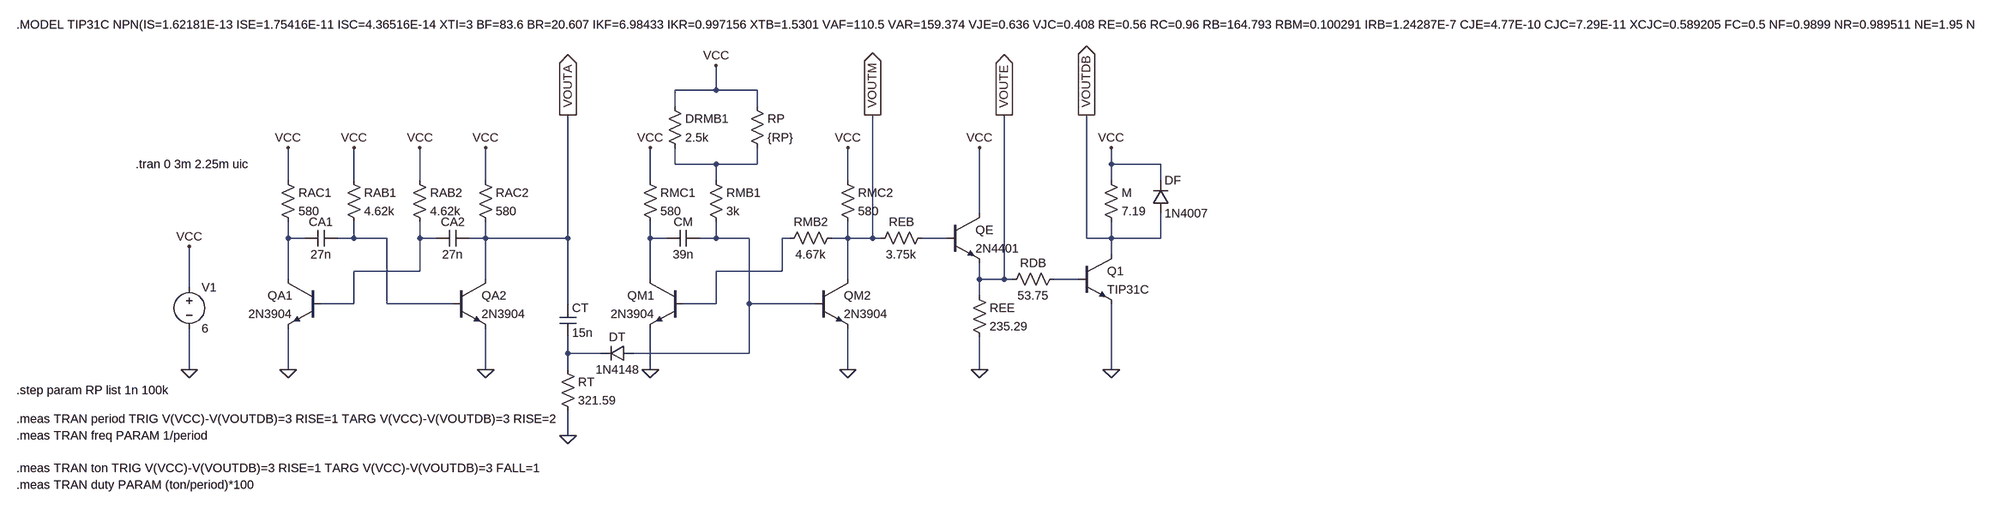
[diagram p0: schematic partly.asc]
partly.asc, the LTspice schematic file:
Version 4.1
SHEET 1 5716 680
WIRE 1056 -304 1056 -352
WIRE 1056 -304 976 -304
WIRE 1136 -304 1056 -304
WIRE 976 -272 976 -304
WIRE 1136 -272 1136 -304
WIRE 976 -160 976 -192
WIRE 1056 -160 976 -160
WIRE 1136 -160 1136 -192
WIRE 1136 -160 1056 -160
WIRE 1824 -160 1824 -192
WIRE 1920 -160 1824 -160
WIRE 224 -128 224 -192
WIRE 352 -128 352 -192
WIRE 480 -128 480 -192
WIRE 608 -128 608 -192
WIRE 928 -128 928 -192
WIRE 1056 -128 1056 -160
WIRE 1312 -128 1312 -192
WIRE 1824 -128 1824 -160
WIRE 1920 -128 1920 -160
WIRE 1568 -64 1568 -192
WIRE 224 -16 224 -48
WIRE 256 -16 224 -16
WIRE 352 -16 352 -48
WIRE 352 -16 320 -16
WIRE 416 -16 352 -16
WIRE 480 -16 480 -48
WIRE 512 -16 480 -16
WIRE 608 -16 608 -48
WIRE 608 -16 576 -16
WIRE 768 -16 768 -256
WIRE 768 -16 608 -16
WIRE 928 -16 928 -48
WIRE 960 -16 928 -16
WIRE 1056 -16 1056 -48
WIRE 1056 -16 1024 -16
WIRE 1120 -16 1056 -16
WIRE 1200 -16 1184 -16
WIRE 1312 -16 1312 -48
WIRE 1312 -16 1280 -16
WIRE 1360 -16 1360 -256
WIRE 1360 -16 1312 -16
WIRE 1376 -16 1360 -16
WIRE 1504 -16 1456 -16
WIRE 1776 -16 1776 -256
WIRE 1824 -16 1824 -48
WIRE 1824 -16 1776 -16
WIRE 1920 -16 1920 -64
WIRE 1920 -16 1824 -16
WIRE 1824 16 1824 -16
WIRE 480 48 480 -16
WIRE 480 48 352 48
WIRE 1184 48 1184 -16
WIRE 1184 48 1056 48
WIRE 224 64 224 -16
WIRE 608 64 608 -16
WIRE 928 64 928 -16
WIRE 1312 64 1312 -16
WIRE 1568 64 1568 32
WIRE 1616 64 1616 -256
WIRE 1616 64 1568 64
WIRE 1632 64 1616 64
WIRE 1760 64 1712 64
WIRE 32 80 32 0
WIRE 1568 96 1568 64
WIRE 352 112 352 48
WIRE 352 112 288 112
WIRE 416 112 416 -16
WIRE 544 112 416 112
WIRE 768 112 768 -16
WIRE 1056 112 1056 48
WIRE 1056 112 992 112
WIRE 1120 112 1120 -16
WIRE 1248 112 1120 112
WIRE 768 208 768 176
WIRE 832 208 768 208
WIRE 1120 208 1120 112
WIRE 1120 208 896 208
WIRE 32 240 32 160
WIRE 224 240 224 160
WIRE 608 240 608 160
WIRE 768 240 768 208
WIRE 928 240 928 160
WIRE 1312 240 1312 160
WIRE 1568 240 1568 176
WIRE 1824 240 1824 112
WIRE 768 368 768 320
FLAG 224 -192 VCC
FLAG 352 -192 VCC
FLAG 480 -192 VCC
FLAG 608 -192 VCC
FLAG 608 240 0
FLAG 224 240 0
FLAG 32 240 0
FLAG 32 0 VCC
FLAG 928 -192 VCC
FLAG 1312 -192 VCC
FLAG 1312 240 0
FLAG 928 240 0
FLAG 1056 -352 VCC
FLAG 768 368 0
FLAG 1568 240 0
FLAG 1568 -192 VCC
FLAG 1824 240 0
FLAG 1824 -192 VCC
FLAG 768 -256 VOUTA
IOPIN 768 -256 Out
FLAG 1360 -256 VOUTM
IOPIN 1360 -256 Out
FLAG 1616 -256 VOUTE
IOPIN 1616 -256 Out
FLAG 1776 -256 VOUTDB
IOPIN 1776 -256 Out
SYMBOL res 208 -144 R0
SYMATTR InstName RAC1
SYMATTR Value 580
SYMBOL cap 320 -32 R90
WINDOW 0 0 32 VBottom 2
WINDOW 3 32 32 VTop 2
SYMATTR InstName CA1
SYMATTR Value 27n
SYMBOL res 336 -144 R0
SYMATTR InstName RAB1
SYMATTR Value 4.62k
SYMBOL res 464 -144 R0
SYMATTR InstName RAB2
SYMATTR Value 4.62k
SYMBOL cap 576 -32 R90
WINDOW 0 0 32 VBottom 2
WINDOW 3 32 32 VTop 2
SYMATTR InstName CA2
SYMATTR Value 27n
SYMBOL res 592 -144 R0
SYMATTR InstName RAC2
SYMATTR Value 580
SYMBOL npn 544 64 R0
SYMATTR InstName QA2
SYMATTR Value 2N3904
SYMBOL npn 288 64 M0
SYMATTR InstName QA1
SYMATTR Value 2N3904
SYMBOL voltage 32 64 R0
SYMATTR InstName V1
SYMATTR Value 6
SYMBOL res 912 -144 R0
SYMATTR InstName RMC1
SYMATTR Value 580
SYMBOL cap 1024 -32 R90
WINDOW 0 0 32 VBottom 2
WINDOW 3 32 32 VTop 2
SYMATTR InstName CM
SYMATTR Value 39n
SYMBOL res 1040 -144 R0
SYMATTR InstName RMB1
SYMATTR Value 3k
SYMBOL res 1296 -144 R0
SYMATTR InstName RMC2
SYMATTR Value 580
SYMBOL npn 1248 64 R0
SYMATTR InstName QM2
SYMATTR Value 2N3904
SYMBOL npn 992 64 M0
SYMATTR InstName QM1
SYMATTR Value 2N3904
SYMBOL res 1296 -32 R90
WINDOW 0 0 56 VBottom 2
WINDOW 3 32 56 VTop 2
SYMATTR InstName RMB2
SYMATTR Value 4.67k
SYMBOL res 960 -288 R0
SYMATTR InstName DRMB1
SYMATTR Value 2.5k
SYMBOL res 1120 -288 R0
SYMATTR InstName RP
SYMATTR Value {RP}
SYMBOL res 752 224 R0
SYMATTR InstName RT
SYMATTR Value 321.59
SYMBOL diode 896 192 R90
WINDOW 0 0 32 VBottom 2
WINDOW 3 32 32 VTop 2
SYMATTR InstName DT
SYMATTR Value 1N4148
SYMBOL cap 752 112 R0
SYMATTR InstName CT
SYMATTR Value 15n
SYMBOL res 1472 -32 R90
WINDOW 0 0 56 VBottom 2
WINDOW 3 32 56 VTop 2
SYMATTR InstName REB
SYMATTR Value 3.75k
SYMBOL npn 1504 -64 R0
SYMATTR InstName QE
SYMATTR Value 2N4401
SYMBOL res 1552 80 R0
SYMATTR InstName REE
SYMATTR Value 235.29
SYMBOL res 1728 48 R90
WINDOW 0 0 56 VBottom 2
WINDOW 3 32 56 VTop 2
SYMATTR InstName RDB
SYMATTR Value 53.75
SYMBOL npn 1760 16 R0
SYMATTR InstName Q1
SYMATTR Value TIP31C
SYMBOL res 1808 -144 R0
SYMATTR InstName M
SYMATTR Value 7.19
SYMBOL diode 1904 -64 M180
WINDOW 0 24 64 Left 2
WINDOW 3 24 0 Left 2
SYMATTR InstName DF
SYMATTR Value 1N4007
TEXT -72 -160 Left 2 !.tran 0 3m 2.25m uic
TEXT -304 -432 Left 2 !.MODEL TIP31C NPN(IS=1.62181E-13 ISE=1.75416E-11 ISC=4.36516E-14 XTI=3 BF=83.6 BR=20.607 IKF=6.98433 IKR=0.997156 XTB=1.5301 VAF=110.5 VAR=159.374 VJE=0.636 VJC=0.408 RE=0.56 RC=0.96 RB=164.793 RBM=0.100291 IRB=1.24287E-7 CJE=4.77E-10 CJC=7.29E-11 XCJC=0.589205 FC=0.5 NF=0.9899 NR=0.989511 NE=1.95 NC=1.014 MJE=0.327 MJC=0.339 TF=2.3733E-8 TR=1.0000E-8 ITF=1 VTF=10 XTF=10 EG=1.1605 VCEO=100 ICRATING=3 MFG=TEXAS)
TEXT -304 336 Left 2 !.meas TRAN period TRIG V(VCC)-V(VOUTDB)=3 RISE=1 TARG V(VCC)-V(VOUTDB)=3 RISE=2
TEXT -304 368 Left 2 !.meas TRAN freq PARAM 1/period
TEXT -304 432 Left 2 !.meas TRAN ton TRIG V(VCC)-V(VOUTDB)=3 RISE=1 TARG V(VCC)-V(VOUTDB)=3 FALL=1
TEXT -304 464 Left 2 !.meas TRAN duty PARAM (ton/period)*100
TEXT -304 280 Left 2 !.step param RP list 1n 100k

The netlist it stands for:
* partly.asc
RAC1 VCC N002 580
CA1 N003 N002 27n
RAB1 VCC N003 4.62k
RAB2 VCC N004 4.62k
CA2 VOUTA N004 27n
RAC2 VCC VOUTA 580
QA2 VOUTA N003 0 0 2N3904
QA1 N002 N004 0 0 2N3904
V1 VCC 0 6
RMC1 VCC N005 580
CM N006 N005 39n
RMB1 N001 N006 3k
RMC2 VCC VOUTM 580
QM2 VOUTM N006 0 0 2N3904
QM1 N005 N007 0 0 2N3904
RMB2 VOUTM N007 4.67k
R§DRMB1 VCC N001 2.5k
RP VCC N001 {RP}
RT N010 0 321.59
DT N006 N010 1N4148
CT VOUTA N010 15n
REB N008 VOUTM 3.75k
QE VCC N008 VOUTE 0 2N4401
REE VOUTE 0 235.29
RDB N009 VOUTE 53.75
Q1 VOUTDB N009 0 0 TIP31C
R§M VCC VOUTDB 7.19
DF VOUTDB VCC 1N4007
.model D D
.lib standard.dio
.model NPN NPN
.model PNP PNP
.lib standard.bjt
.tran 0 3m 2.25m uic
.MODEL TIP31C NPN(IS=1.62181E-13 ISE=1.75416E-11 ISC=4.36516E-14 XTI=3 BF=83.6 BR=20.607 IKF=6.98433 IKR=0.997156 XTB=1.5301 VAF=110.5 VAR=159.374 VJE=0.636 VJC=0.408 RE=0.56 RC=0.96 RB=164.793 RBM=0.100291 IRB=1.24287E-7 CJE=4.77E-10 CJC=7.29E-11 XCJC=0.589205 FC=0.5 NF=0.9899 NR=0.989511 NE=1.95 NC=1.014 MJE=0.327 MJC=0.339 TF=2.3733E-8 TR=1.0000E-8 ITF=1 VTF=10 XTF=10 EG=1.1605 VCEO=100 ICRATING=3 MFG=TEXAS)
.meas TRAN period TRIG V(VCC)-V(VOUTDB)=3 RISE=1 TARG V(VCC)-V(VOUTDB)=3 RISE=2
.meas TRAN freq PARAM 1/period
.meas TRAN ton TRIG V(VCC)-V(VOUTDB)=3 RISE=1 TARG V(VCC)-V(VOUTDB)=3 FALL=1
.meas TRAN duty PARAM (ton/period)*100
.step param RP list 1n 100k
.backanno
.end